# EAGLE schematic CC-Multi-Pak (EAGLE 5.10)

## Sheet 1 of 8
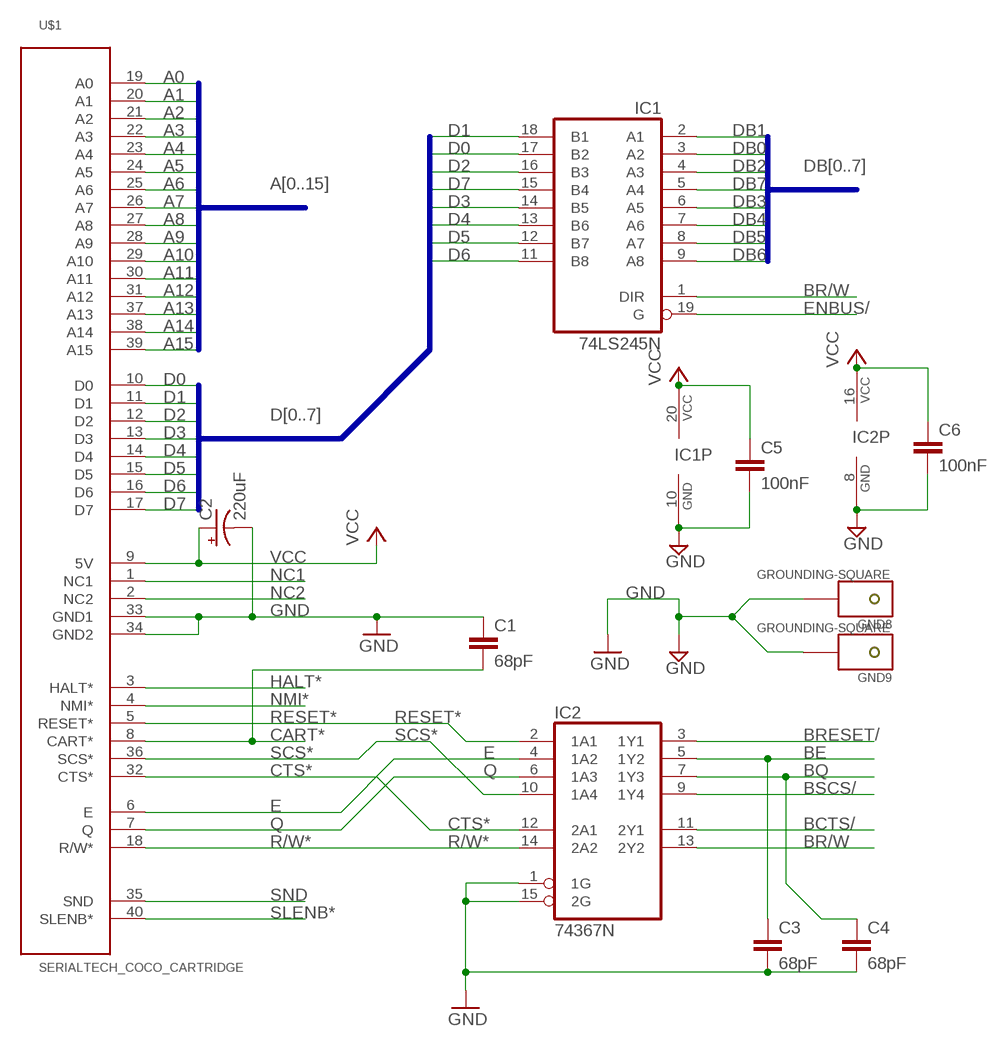
[diagram p0: schematic, sheet 1]

### Parts
C1  68pF  C2.5/6  [C2.5-6]
C2  220uF  SPARKFUN_CAP_POLPTH1  [SPARKFUN_CPOL-RADIAL-100UF-25V]
C3  68pF  C2.5/6  [C2.5-6]
C4  68pF  C2.5/6  [C2.5-6]
C5  100nF  C2.5/4  [C2.5-4]
C6  100nF  C2.5/4  [C2.5-4]
GND8  GROUNDING-SQUARE  [SQUARE]
GND9  GROUNDING-SQUARE  [SQUARE]
IC1  74LS245N  [DIL20]
IC2  74367N  [DIL16]
U$1  SERIALTECH_COCO_CARTRIDGE  [SERIALTECH_EDGE40]

### Nets
A0: U$1.19(A0) ; also sheet 2
A1: U$1.20(A1) ; also sheet 2
A2: U$1.21(A2) ; also sheet 2
A3: U$1.22(A3) ; also sheet 2
A4: U$1.23(A4) ; also sheet 2
A5: U$1.24(A5) ; also sheet 2
A6: U$1.25(A6) ; also sheet 2
A7: U$1.26(A7) ; also sheet 2
A8: U$1.27(A8) ; also sheet 2
A9: U$1.28(A9) ; also sheet 2
A10: U$1.29(A10) ; also sheet 2
A11: U$1.30(A11) ; also sheet 2
A12: U$1.31(A12) ; also sheet 2
A13: U$1.37(A13) ; also sheet 2
A14: U$1.38(A14) ; also sheet 2
A15: U$1.39(A15) ; also sheet 2
BCTS/: IC2.11(2Y1) ; also sheet 3,4
BE: C3.1 IC2.5(1Y2) ; also sheet 4,5
BQ: C4.1 IC2.7(1Y3) ; also sheet 4,5
BR/W: IC1.1(DIR) IC2.13(2Y2) ; also sheet 4,5
BRESET/: IC2.3(1Y1) ; also sheet 3,5
BSCS/: IC2.9(1Y4) ; also sheet 3
CART*: C1.2 U$1.8(CART*) ; also sheet 3
CTS*: IC2.12(2A1) U$1.32(CTS*)
D0: IC1.17(B2) U$1.10(D0)
D1: IC1.18(B1) U$1.11(D1)
D2: IC1.16(B3) U$1.12(D2)
D3: IC1.14(B5) U$1.13(D3)
D4: IC1.13(B6) U$1.14(D4)
D5: IC1.12(B7) U$1.15(D5)
D6: IC1.11(B8) U$1.16(D6)
D7: IC1.15(B4) U$1.17(D7)
DB0: IC1.3(A2) ; also sheet 3,5
DB1: IC1.2(A1) ; also sheet 3,5
DB2: IC1.4(A3) ; also sheet 3,5
DB3: IC1.6(A5) ; also sheet 3,5
DB4: IC1.7(A6) ; also sheet 3,5
DB5: IC1.8(A7) ; also sheet 3,5
DB6: IC1.9(A8) ; also sheet 2,3,5
DB7: IC1.5(A4) ; also sheet 2,3,5
E: IC2.4(1A2) U$1.6(E)
ENBUS/: IC1.19(G) ; also sheet 4
GND [gnd]: C1.1 C2.2(-) C3.2 C4.2 C5.2 C6.2 GND8.GND GND9.GND IC1.10(GND) IC2.1(1G) IC2.8(GND) IC2.15(2G) U$1.33(GND1) U$1.34(GND2) ; also sheet 2,3,4,5,6,7,8
HALT*: U$1.3(HALT*) ; also sheet 5
NC1: U$1.1(NC1)
NC2: U$1.2(NC2)
NMI*: U$1.4(NMI*) ; also sheet 5
Q: IC2.6(1A3) U$1.7(Q)
R/W*: IC2.14(2A2) U$1.18(R/W*)
RESET*: IC2.2(1A1) U$1.5(RESET*) ; also sheet 8
SCS*: IC2.10(1A4) U$1.36(SCS*)
SLENB*: U$1.40(SLENB*) ; also sheet 4,5
SND: U$1.35(SND) ; also sheet 5
VCC [vcc]: C2.1(+) C5.1 C6.1 IC1.20(VCC) IC2.16(VCC) U$1.9(5V) ; also sheet 2,3,4,6,8

### Buses
A[0..15]
D[0..7]
DB[0..7]

## Sheet 2 of 8
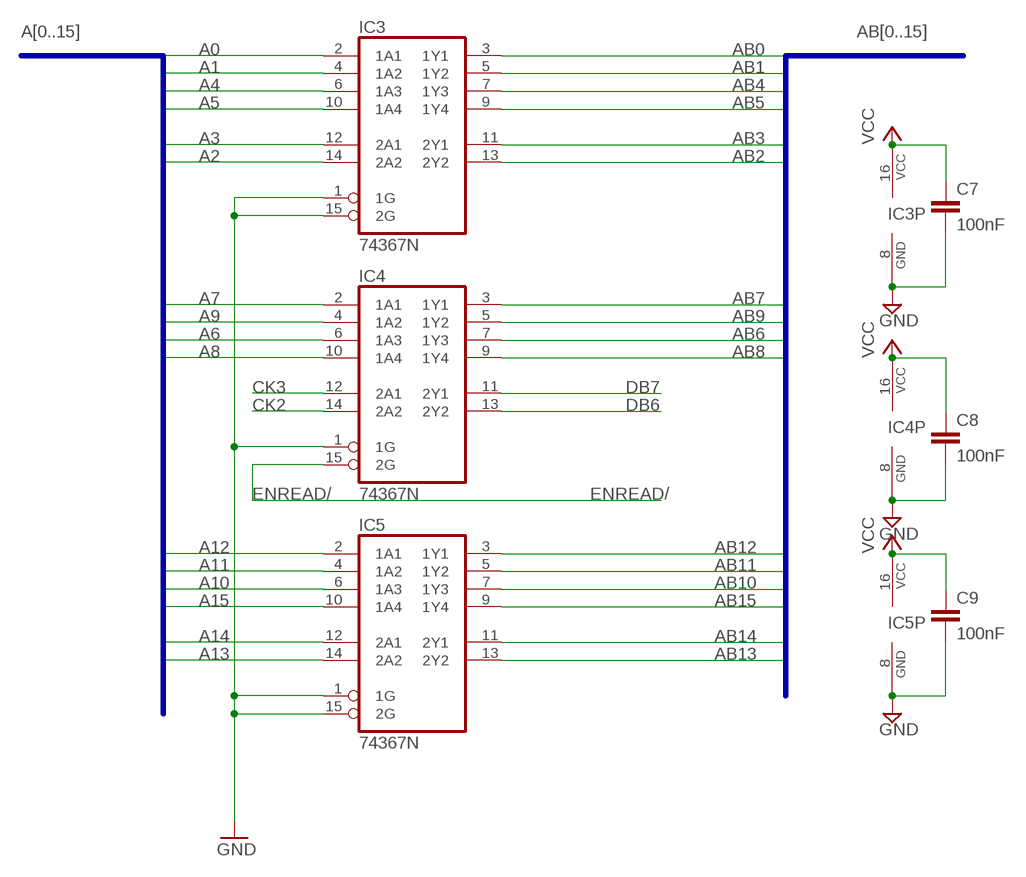
[diagram p1: schematic, sheet 2]

### Parts
C7  100nF  C2.5/4  [C2.5-4]
C8  100nF  C2.5/4  [C2.5-4]
C9  100nF  C2.5/4  [C2.5-4]
IC3  74367N  [DIL16]
IC4  74367N  [DIL16]
IC5  74367N  [DIL16]

### Nets
A0: IC3.2(1A1) ; also sheet 1
A1: IC3.4(1A2) ; also sheet 1
A2: IC3.14(2A2) ; also sheet 1
A3: IC3.12(2A1) ; also sheet 1
A4: IC3.6(1A3) ; also sheet 1
A5: IC3.10(1A4) ; also sheet 1
A6: IC4.6(1A3) ; also sheet 1
A7: IC4.2(1A1) ; also sheet 1
A8: IC4.10(1A4) ; also sheet 1
A9: IC4.4(1A2) ; also sheet 1
A10: IC5.6(1A3) ; also sheet 1
A11: IC5.4(1A2) ; also sheet 1
A12: IC5.2(1A1) ; also sheet 1
A13: IC5.14(2A2) ; also sheet 1
A14: IC5.12(2A1) ; also sheet 1
A15: IC5.10(1A4) ; also sheet 1
AB0: IC3.3(1Y1) ; also sheet 4,5
AB1: IC3.5(1Y2) ; also sheet 4,5
AB2: IC3.13(2Y2) ; also sheet 4,5
AB3: IC3.11(2Y1) ; also sheet 4,5
AB4: IC3.7(1Y3) ; also sheet 4,5
AB5: IC3.9(1Y4) ; also sheet 4,5
AB6: IC4.7(1Y3) ; also sheet 4,5
AB7: IC4.3(1Y1) ; also sheet 4,5
AB8: IC4.9(1Y4) ; also sheet 4,5
AB9: IC4.5(1Y2) ; also sheet 4,5
AB10: IC5.7(1Y3) ; also sheet 4,5
AB11: IC5.5(1Y2) ; also sheet 4,5
AB12: IC5.3(1Y1) ; also sheet 4,5
AB13: IC5.13(2Y2) ; also sheet 4,5
AB14: IC5.11(2Y1) ; also sheet 4,5
AB15: IC5.9(1Y4) ; also sheet 4,5
CK2: IC4.14(2A2) ; also sheet 3
CK3: IC4.12(2A1) ; also sheet 3
DB6: IC4.13(2Y2) ; also sheet 1,3,5
DB7: IC4.11(2Y1) ; also sheet 1,3,5
ENREAD/: IC4.15(2G) ; also sheet 3,4
GND [gnd]: C7.2 C8.2 C9.2 IC3.1(1G) IC3.8(GND) IC3.15(2G) IC4.1(1G) IC4.8(GND) IC5.1(1G) IC5.8(GND) IC5.15(2G) ; also sheet 1,3,4,5,6,7,8
VCC [vcc]: C7.1 C8.1 C9.1 IC3.16(VCC) IC4.16(VCC) IC5.16(VCC) ; also sheet 1,3,4,6,8

### Buses
A[0..15]
AB[0..15]

## Sheet 3 of 8
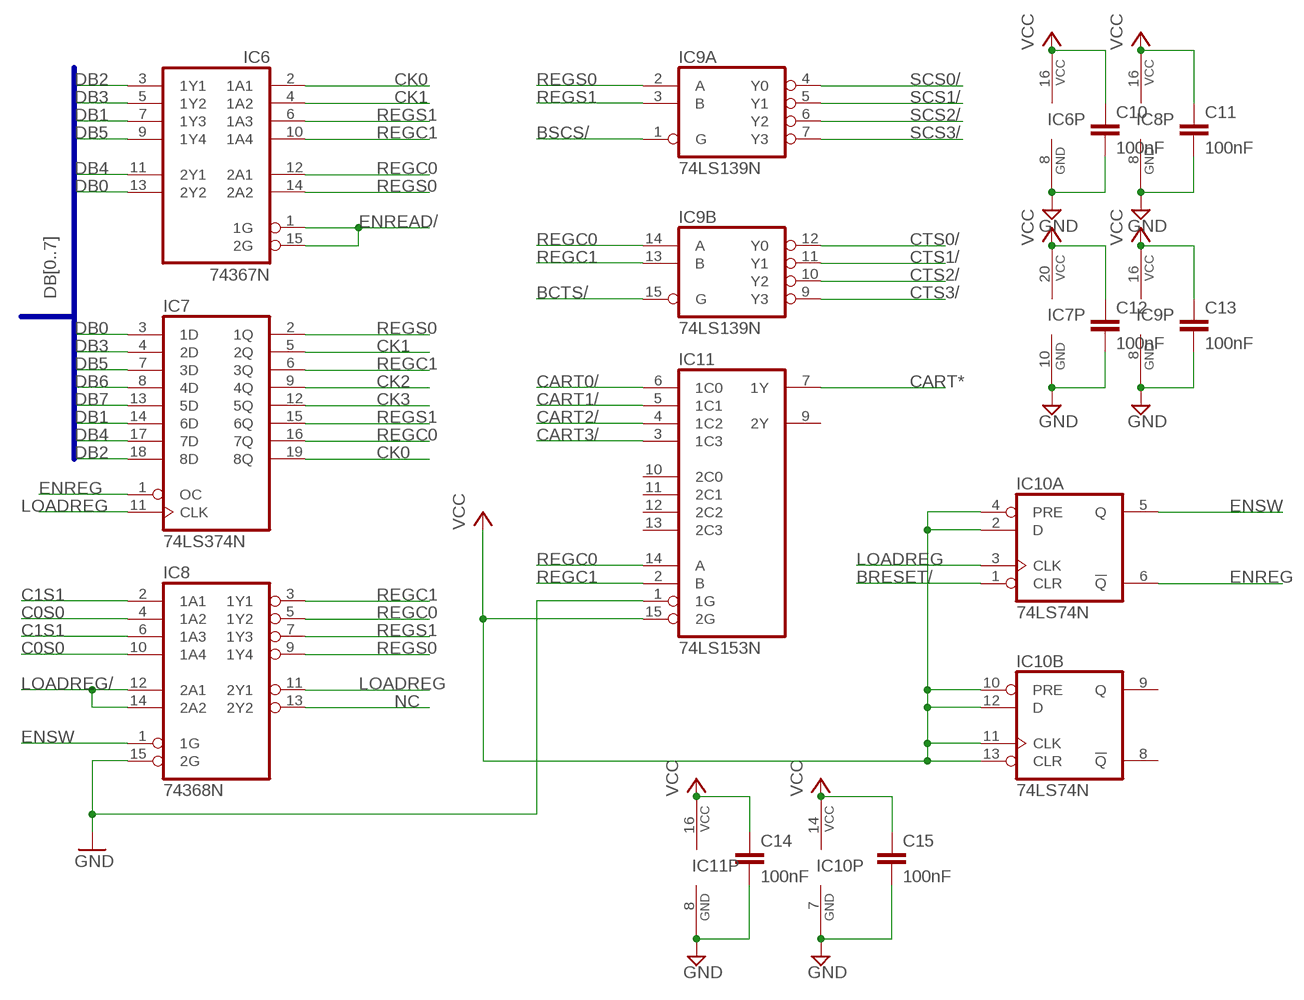
[diagram p2: schematic, sheet 3]

### Parts
C10  100nF  C2.5/4  [C2.5-4]
C11  100nF  C2.5/4  [C2.5-4]
C12  100nF  C2.5/4  [C2.5-4]
C13  100nF  C2.5/4  [C2.5-4]
C14  100nF  C2.5/4  [C2.5-4]
C15  100nF  C2.5/4  [C2.5-4]
IC6  74367N  [DIL16]
IC7  74LS374N  [DIL20]
IC8  74368N  [DIL16]
IC9  74LS139N  [DIL16]
IC10  74LS74N  [DIL14]
IC11  74LS153N  [DIL16]

### Nets
BCTS/: IC9.15(B:G) ; also sheet 1,4
BRESET/: IC10.1(A:CLR) ; also sheet 1,5
BSCS/: IC9.1(A:G) ; also sheet 1
C0S0: IC8.4(1A2) IC8.10(1A4) ; also sheet 6
C1S1: IC8.2(1A1) IC8.6(1A3) ; also sheet 6
CART0/: IC11.6(1C0) ; also sheet 5
CART1/: IC11.5(1C1) ; also sheet 5
CART2/: IC11.4(1C2) ; also sheet 5
CART3/: IC11.3(1C3) ; also sheet 5
CART*: IC11.7(1Y) ; also sheet 1
CK0: IC6.2(1A1) IC7.19(8Q)
CK1: IC6.4(1A2) IC7.5(2Q)
CK2: IC7.9(4Q) ; also sheet 2
CK3: IC7.12(5Q) ; also sheet 2
CTS0/: IC9.12(B:Y0) ; also sheet 5
CTS1/: IC9.11(B:Y1) ; also sheet 5
CTS2/: IC9.10(B:Y2) ; also sheet 5
CTS3/: IC9.9(B:Y3) ; also sheet 5
DB0: IC6.13(2Y2) IC7.3(1D) ; also sheet 1,5
DB1: IC6.7(1Y3) IC7.14(6D) ; also sheet 1,5
DB2: IC6.3(1Y1) IC7.18(8D) ; also sheet 1,5
DB3: IC6.5(1Y2) IC7.4(2D) ; also sheet 1,5
DB4: IC6.11(2Y1) IC7.17(7D) ; also sheet 1,5
DB5: IC6.9(1Y4) IC7.7(3D) ; also sheet 1,5
DB6: IC7.8(4D) ; also sheet 1,2,5
DB7: IC7.13(5D) ; also sheet 1,2,5
ENREAD/: IC6.1(1G) IC6.15(2G) ; also sheet 2,4
ENREG: IC7.1(OC) IC10.6(A:!Q)
ENSW: IC8.1(1G) IC10.5(A:Q)
GND [gnd]: C10.2 C11.2 C12.2 C13.2 C14.2 C15.2 IC6.8(GND) IC7.10(GND) IC8.8(GND) IC8.15(2G) IC9.8(P:GND) IC10.7(P:GND) IC11.1(1G) IC11.8(GND) ; also sheet 1,2,4,5,6,7,8
LOADREG: IC7.11(CLK) IC8.11(2Y1) IC10.3(A:CLK)
LOADREG/: IC8.12(2A1) IC8.14(2A2) ; also sheet 4
NC: IC8.13(2Y2)
REGC0: IC6.12(2A1) IC7.16(7Q) IC8.5(1Y2) IC9.14(B:A) IC11.14(A)
REGC1: IC6.10(1A4) IC7.6(3Q) IC8.3(1Y1) IC9.13(B:B) IC11.2(B)
REGS0: IC6.14(2A2) IC7.2(1Q) IC8.9(1Y4) IC9.2(A:A)
REGS1: IC6.6(1A3) IC7.15(6Q) IC8.7(1Y3) IC9.3(A:B)
SCS0/: IC9.4(A:Y0) ; also sheet 5
SCS1/: IC9.5(A:Y1) ; also sheet 5
SCS2/: IC9.6(A:Y2) ; also sheet 5
SCS3/: IC9.7(A:Y3) ; also sheet 5
VCC [vcc]: C10.1 C11.1 C12.1 C13.1 C14.1 C15.1 IC6.16(VCC) IC7.20(VCC) IC8.16(VCC) IC9.16(P:VCC) IC10.2(A:D) IC10.4(A:PRE) IC10.10(B:PRE) IC10.11(B:CLK) IC10.12(B:D) IC10.13(B:CLR) IC10.14(P:VCC) IC11.15(2G) IC11.16(VCC) ; also sheet 1,2,4,6,8
Unconnected: IC10.8(B:!Q) IC10.9(B:Q) IC11.9(2Y) IC11.10(2C0) IC11.11(2C1) IC11.12(2C2) IC11.13(2C3)

### Buses
DB[0..7]

## Sheet 4 of 8
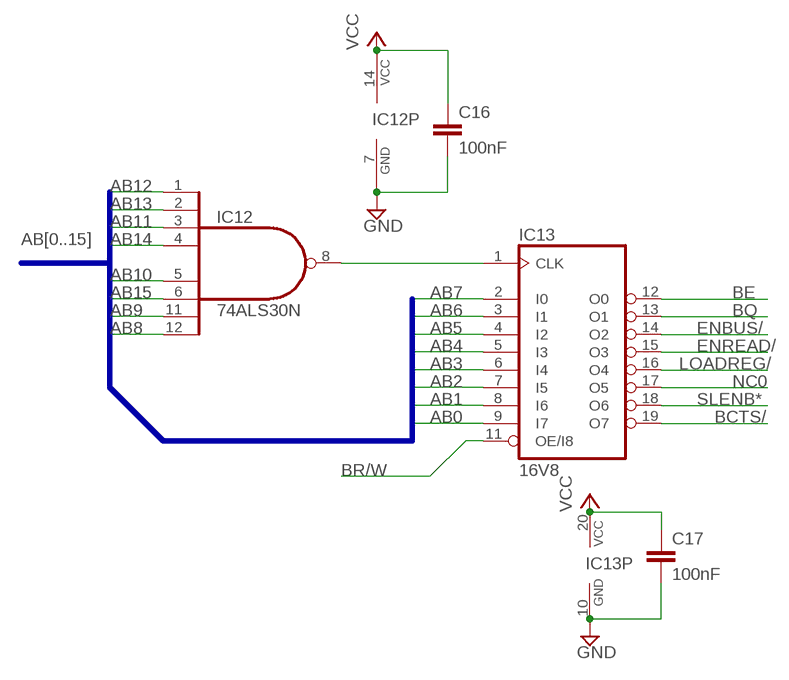
[diagram p3: schematic, sheet 4]

### Parts
C16  100nF  C2.5/4  [C2.5-4]
C17  100nF  C2.5/4  [C2.5-4]
IC12  74ALS30N  [DIL14]
IC13  16V8  [DIL20]

### Nets
AB0: IC13.9(I7) ; also sheet 2,5
AB1: IC13.8(I6) ; also sheet 2,5
AB2: IC13.7(I5) ; also sheet 2,5
AB3: IC13.6(I4) ; also sheet 2,5
AB4: IC13.5(I3) ; also sheet 2,5
AB5: IC13.4(I2) ; also sheet 2,5
AB6: IC13.3(I1) ; also sheet 2,5
AB7: IC13.2(I0) ; also sheet 2,5
AB8: IC12.12(I7) ; also sheet 2,5
AB9: IC12.11(I6) ; also sheet 2,5
AB10: IC12.5(I4) ; also sheet 2,5
AB11: IC12.3(I2) ; also sheet 2,5
AB12: IC12.1(I0) ; also sheet 2,5
AB13: IC12.2(I1) ; also sheet 2,5
AB14: IC12.4(I3) ; also sheet 2,5
AB15: IC12.6(I5) ; also sheet 2,5
BCTS/: IC13.19(O7) ; also sheet 1,3
BE: IC13.12(O0) ; also sheet 1,5
BQ: IC13.13(O1) ; also sheet 1,5
BR/W: IC13.11(OE/I8) ; also sheet 1,5
ENBUS/: IC13.14(O2) ; also sheet 1
ENREAD/: IC13.15(O3) ; also sheet 2,3
GND [gnd]: C16.2 C17.2 IC12.7(GND) IC13.10(GND) ; also sheet 1,2,3,5,6,7,8
LOADREG/: IC13.16(O4) ; also sheet 3
N$1: IC12.8(O) IC13.1(CLK)
NC0: IC13.17(O5)
SLENB*: IC13.18(O6) ; also sheet 1,5
VCC [vcc]: C16.1 C17.1 IC12.14(VCC) IC13.20(VCC) ; also sheet 1,2,3,6,8

### Buses
AB[0..15]

## Sheet 5 of 8
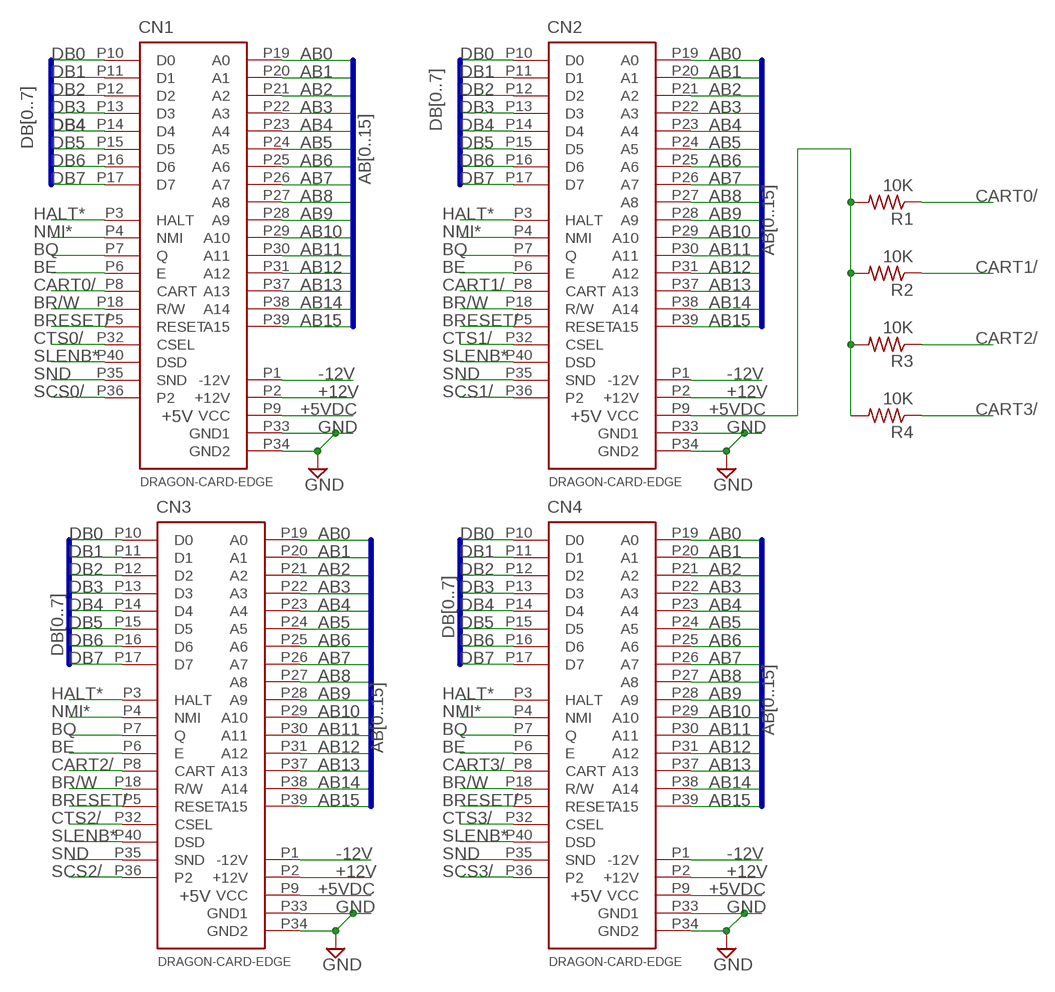
[diagram p4: schematic, sheet 5]

### Parts
CN1  DRAGON-CARD-EDGE  [EDGE-CON-40]
CN2  DRAGON-CARD-EDGE  [EDGE-CON-40]
CN3  DRAGON-CARD-EDGE  [EDGE-CON-40]
CN4  DRAGON-CARD-EDGE  [EDGE-CON-40]
R1  10K  R-US_0207/7  [0207/7]
R2  10K  R-US_0207/7  [0207/7]
R3  10K  R-US_0207/7  [0207/7]
R4  10K  R-US_0207/7  [0207/7]

### Nets
+5VDC [5v]: CN1.P9(VCC) CN2.P9(VCC) CN3.P9(VCC) CN4.P9(VCC) R1.2 R2.2 R3.2 R4.2 ; also sheet 7,8
+12V [12v]: CN1.P2(+12V) CN2.P2(+12V) CN3.P2(+12V) CN4.P2(+12V) ; also sheet 7
-12V: CN1.P1(-12V) CN2.P1(-12V) CN3.P1(-12V) CN4.P1(-12V) ; also sheet 7
AB0: CN1.P19(A0) CN2.P19(A0) CN3.P19(A0) CN4.P19(A0) ; also sheet 2,4
AB1: CN1.P20(A1) CN2.P20(A1) CN3.P20(A1) CN4.P20(A1) ; also sheet 2,4
AB2: CN1.P21(A2) CN2.P21(A2) CN3.P21(A2) CN4.P21(A2) ; also sheet 2,4
AB3: CN1.P22(A3) CN2.P22(A3) CN3.P22(A3) CN4.P22(A3) ; also sheet 2,4
AB4: CN1.P23(A4) CN2.P23(A4) CN3.P23(A4) CN4.P23(A4) ; also sheet 2,4
AB5: CN1.P24(A5) CN2.P24(A5) CN3.P24(A5) CN4.P24(A5) ; also sheet 2,4
AB6: CN1.P25(A6) CN2.P25(A6) CN3.P25(A6) CN4.P25(A6) ; also sheet 2,4
AB7: CN1.P26(A7) CN2.P26(A7) CN3.P26(A7) CN4.P26(A7) ; also sheet 2,4
AB8: CN1.P27(A8) CN2.P27(A8) CN3.P27(A8) CN4.P27(A8) ; also sheet 2,4
AB9: CN1.P28(A9) CN2.P28(A9) CN3.P28(A9) CN4.P28(A9) ; also sheet 2,4
AB10: CN1.P29(A10) CN2.P29(A10) CN3.P29(A10) CN4.P29(A10) ; also sheet 2,4
AB11: CN1.P30(A11) CN2.P30(A11) CN3.P30(A11) CN4.P30(A11) ; also sheet 2,4
AB12: CN1.P31(A12) CN2.P31(A12) CN3.P31(A12) CN4.P31(A12) ; also sheet 2,4
AB13: CN1.P37(A13) CN2.P37(A13) CN3.P37(A13) CN4.P37(A13) ; also sheet 2,4
AB14: CN1.P38(A14) CN2.P38(A14) CN3.P38(A14) CN4.P38(A14) ; also sheet 2,4
AB15: CN1.P39(A15) CN2.P39(A15) CN3.P39(A15) CN4.P39(A15) ; also sheet 2,4
BE: CN1.P6(E) CN2.P6(E) CN3.P6(E) CN4.P6(E) ; also sheet 1,4
BQ: CN1.P7(Q) CN2.P7(Q) CN3.P7(Q) CN4.P7(Q) ; also sheet 1,4
BR/W: CN1.P18(R/W) CN2.P18(R/W) CN3.P18(R/W) CN4.P18(R/W) ; also sheet 1,4
BRESET/: CN1.P5(RESET) CN2.P5(RESET) CN3.P5(RESET) CN4.P5(RESET) ; also sheet 1,3
CART0/: CN1.P8(CART) R1.1 ; also sheet 3
CART1/: CN2.P8(CART) R2.1 ; also sheet 3
CART2/: CN3.P8(CART) R3.1 ; also sheet 3
CART3/: CN4.P8(CART) R4.1 ; also sheet 3
CTS0/: CN1.P32(CSEL) ; also sheet 3
CTS1/: CN2.P32(CSEL) ; also sheet 3
CTS2/: CN3.P32(CSEL) ; also sheet 3
CTS3/: CN4.P32(CSEL) ; also sheet 3
DB0: CN1.P10(D0) CN2.P10(D0) CN3.P10(D0) CN4.P10(D0) ; also sheet 1,3
DB1: CN1.P11(D1) CN2.P11(D1) CN3.P11(D1) CN4.P11(D1) ; also sheet 1,3
DB2: CN1.P12(D2) CN2.P12(D2) CN3.P12(D2) CN4.P12(D2) ; also sheet 1,3
DB3: CN1.P13(D3) CN2.P13(D3) CN3.P13(D3) CN4.P13(D3) ; also sheet 1,3
DB4: CN1.P14(D4) CN2.P14(D4) CN3.P14(D4) CN4.P14(D4) ; also sheet 1,3
DB5: CN1.P15(D5) CN2.P15(D5) CN3.P15(D5) CN4.P15(D5) ; also sheet 1,3
DB6: CN1.P16(D6) CN2.P16(D6) CN3.P16(D6) CN4.P16(D6) ; also sheet 1,2,3
DB7: CN1.P17(D7) CN2.P17(D7) CN3.P17(D7) CN4.P17(D7) ; also sheet 1,2,3
GND [gnd]: CN1.P33(GND1) CN1.P34(GND2) CN2.P33(GND1) CN2.P34(GND2) CN3.P33(GND1) CN3.P34(GND2) CN4.P33(GND1) CN4.P34(GND2) ; also sheet 1,2,3,4,6,7,8
HALT*: CN1.P3(HALT) CN2.P3(HALT) CN3.P3(HALT) CN4.P3(HALT) ; also sheet 1
NMI*: CN1.P4(NMI) CN2.P4(NMI) CN3.P4(NMI) CN4.P4(NMI) ; also sheet 1
SCS0/: CN1.P36(P2) ; also sheet 3
SCS1/: CN2.P36(P2) ; also sheet 3
SCS2/: CN3.P36(P2) ; also sheet 3
SCS3/: CN4.P36(P2) ; also sheet 3
SLENB*: CN1.P40(DSD) CN2.P40(DSD) CN3.P40(DSD) CN4.P40(DSD) ; also sheet 1,4
SND: CN1.P35(SND) CN2.P35(SND) CN3.P35(SND) CN4.P35(SND) ; also sheet 1

### Buses
DB[0..7]
AB[0..15]

## Sheet 6 of 8
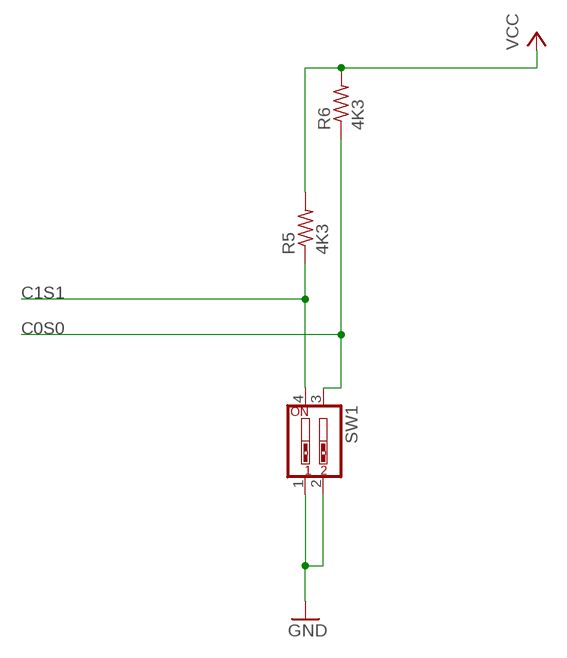
[diagram p5: schematic, sheet 6]

### Parts
R5  4K3  R-US_0207/7  [0207/7]
R6  4K3  R-US_0207/7  [0207/7]
SW1  SW_DIP-2  [DIPSWITCH-02]

### Nets
C0S0: R6.1 SW1.3 ; also sheet 3
C1S1: R5.1 SW1.4 ; also sheet 3
GND [gnd]: SW1.1 SW1.2 ; also sheet 1,2,3,4,5,7,8
VCC [vcc]: R5.2 R6.2 ; also sheet 1,2,3,4,8

## Sheet 7 of 8
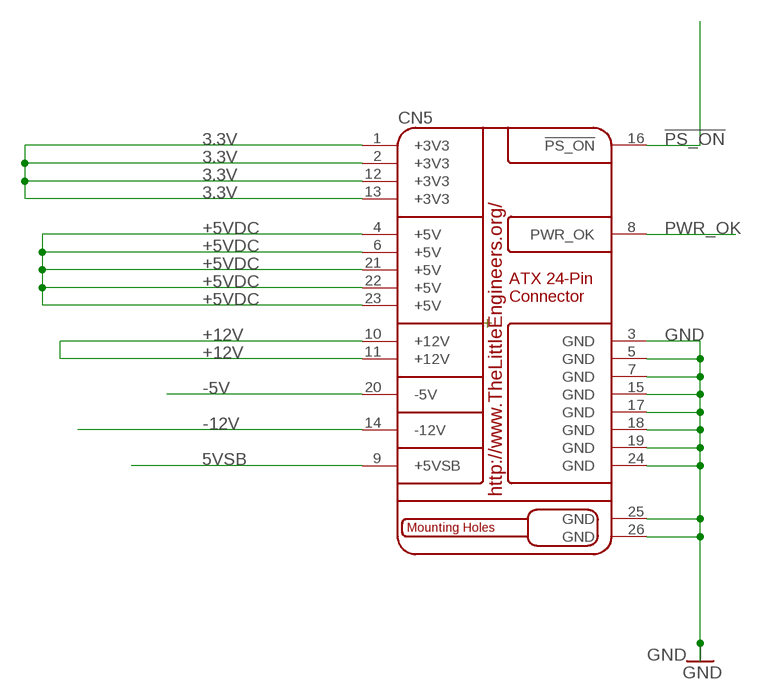
[diagram p6: schematic, sheet 7]

### Parts
CN5  ATX-2.X-UNIVERSAL  [ATX-UNIVERSAL]

### Nets
3.3V [3.3v]: CN5.1(+3V3) CN5.2(+3V3) CN5.12(+3V3) CN5.13(+3V3)
5VSB: CN5.9(+5VSB)
!PS_ON: CN5.16(!PS_ON) ; also sheet 8
+5VDC [5v]: CN5.4(+5V) CN5.6(+5V) CN5.21(+5V) CN5.22(+5V) CN5.23(+5V) ; also sheet 5,8
+12V [12v]: CN5.10(+12V) CN5.11(+12V) ; also sheet 5
-5V [-5v]: CN5.20(-5V)
-12V: CN5.14(-12V) ; also sheet 5
GND [gnd]: CN5.3(GND) CN5.5(GND) CN5.7(GND) CN5.15(GND) CN5.17(GND) CN5.18(GND) CN5.19(GND) CN5.24(GND) CN5.25(GND) CN5.26(GND) ; also sheet 1,2,3,4,5,6,8
PWR_OK: CN5.8(PWR_OK) ; also sheet 8

## Sheet 8 of 8
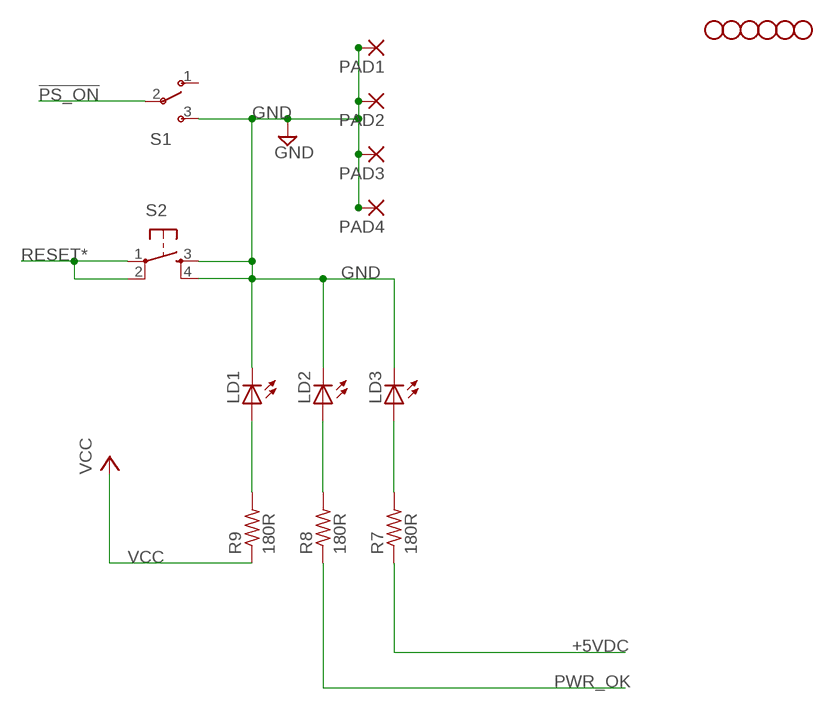
[diagram p7: schematic, sheet 8]

### Parts
LD1  LED5MM  [LED5MM]
LD2  LED5MM  [LED5MM]
LD3  LED5MM  [LED5MM]
PAD1  3,81/1,4  [3,81/1,4]
PAD2  3,81/1,4  [3,81/1,4]
PAD3  3,81/1,4  [3,81/1,4]
PAD4  3,81/1,4  [3,81/1,4]
R7  180R  R-US_0207/7  [0207/7]
R8  180R  R-US_0207/7  [0207/7]
R9  180R  R-US_0207/7  [0207/7]
S1  SWITCH-SPST  [SWITCH-SPST]
S2  TAC_SWITCHPTH  [TACTILE-PTH]
U$2  SPARKFUN_STAND-OFF  [SPARKFUN_STAND-OFF]
U$3  SPARKFUN_STAND-OFF  [SPARKFUN_STAND-OFF]
U$4  SPARKFUN_STAND-OFF  [SPARKFUN_STAND-OFF]
U$5  SPARKFUN_STAND-OFF  [SPARKFUN_STAND-OFF]
U$6  SPARKFUN_STAND-OFF  [SPARKFUN_STAND-OFF]
U$7  SPARKFUN_STAND-OFF  [SPARKFUN_STAND-OFF]

### Nets
!PS_ON: S1.2(P) ; also sheet 7
+5VDC [5v]: R7.1 ; also sheet 5,7
GND [gnd]: LD1.K(C) LD2.K(C) LD3.K(C) PAD1.1(P) PAD2.1(P) PAD3.1(P) PAD4.1(P) S1.3(S) S2.3 S2.4 ; also sheet 1,2,3,4,5,6,7
N$2: LD1.A R9.2
N$3: LD2.A R8.2
N$4: LD3.A R7.2
PWR_OK: R8.1 ; also sheet 7
RESET*: S2.1 S2.2 ; also sheet 1
VCC [vcc]: R9.1 ; also sheet 1,2,3,4,6
Unconnected: S1.1(O)

## Library data of the parts
C1 C3-C17 = capacitor-wima:C: CAPACITOR naming: grid - package width
C2 = FDC:SPARKFUN_CAP_POL: Capacitor Polarized These are standard SMD and PTH capacitors. Normally 10uF, 47uF, and 100uF in electrolytic and tantalum varieties. Always verify the external diameter of the through hole cap, it varies with capacity, voltage, and manufacturer. The EIA devices should be standard.
CN1-CN4 = Conn-CoCo:DRAGON-CARD-EDGE: Dragon and CoCo cartridge port, as seen by computer, or Multipak
CN5 = ATX_Power_Supply:ATX-2.X: 24-pin ATX PC-Motherboard 2.x Power Supply Connector. 24-pin ATX PC-Motherboard 2.x Power Supply Connector. 24-pin ATX PC-Motherboard 2.x Power Supply Connector. Package: 5566-24 Mini FIT connector 24 pin. Source: http://www.molex.com This is the Molex connector originally developed by Molex Connector Company. In the connector, cylindrical spring-metal pins fit into cylindrical spring-metal sockets. The pins and sockets are held in a rectangular matrix in a nylon shell. The connector typically is polarized or keyed to ensure correct orientation. The connector may also be known as: MOLEX-5566-24, MOLEX-5566-24A, MOLEX-44206-0007, Molex Mini-fit, Molex Mini-fit Jr., and others. The actual component that you intend to use in your design should be checked against a 1:1 printout of this library component/footprint prior to use. Color Signal Pin Pin Signal Color Orange +3.3 V 1 13 +3.3 V Orange +3.3 V sense Brown Orange +3.3 V 2 14 -12 V Blue Black Ground 3 15 Ground Black Red +5 V 4 16 Power on Green Black Ground 5 17 Ground Black Red +5 V 6 18 Ground Black Black Ground 7 19 Ground Black Grey Power good 8 20 -5 V (Optional) White Purple +5 V standby 9 21 +5 V Red Yellow +12 V 10 22 +5 V Red Yellow +12 V 11 23 +5 V Red Orange +3.3 V 12 24 Ground Black Pins 8, and 16 (shaded) are control signals, not power: Power on is pulled up to +5 V by the PSU, and must be driven low to turn on the PSU. Power good is low when other outputs have not yet reached, or are about to leave, correct voltages. Pin 13 supplies +3.3 V power and also has a second thinner wire for remote sensing. Pin 20 (formerly -5 V, white wire) is absent in current power supplies; it was optional in ATX and ATX12V ver. 1.2, and deleted as of ver. 1.3. Copyright ©11 November 2013 (Happy Veteran's Day), by: John Turner Licensed to: RetroZilla, LLC <http://www.RetroZillaLLC.com> sales@RetroZillaLLC.com RetroZilla, LLC <http://www.RetroZillaLLC.com> symbols/components/footprints for EAGLE v5.xx. The symbols/components/footprints contained within this library were created by John Turner and have been licensed to RetroZilla, LLC. <http://www.RetroZillaLLC.com> You may use these symbols/components/footprints in your own projects, for non-commercial purposes only, however, please take note that we CANNOT guarantee the accuracy of these symbols/components/footprints nor any part of this library. We make NO guarantees that the components, footprints or schematic symbols in this library are flawless, and we make no promises of fitness for production, prototyping or any other purpose. These libraries are provided for informational purposes only, and are used at your own discretion. By downloading and/or using these libraries, you agree that we cannot be held responsible for faulty PCBs. You should always check the footprints with a 1:1 printout. Neither John Turner, RetroZillaLLC.com, RetroZilla, LLC <http://www.RetroZillaLLC.com> nor anyone affiliated with same shall be held responsible for any outcome resulting from the usage of these files (library/symbols/components/footprints, etc). Should any errors be found, please contact us at the above email address and we will attempt to repair them.
GND8 GND9 = CC2-BufferPack-V1R0-21-May-2019:GROUNDING
IC1 = 74xx-us:74*245: Octal BUS TRANSCEIVER, 3-state
IC2-IC6 = 74xx-us:74*367: Hex BUS DRIVER, 3-state
IC7 = 74xx-us:74*374: Octal D type transparent LATCH, edge triggered
IC8 = 74xx-us:74*368: Hex BUS DRIVER, 3-state
IC9 = 74xx-us:74*139: Dual 2-line to 4-line DECODER/DEMULTIPLEXER
IC10 = 74xx-us:74*74: Dual D type positive edge triggered FLIP FLOP, preset and clear
IC11 = 74xx-us:74*153: Dual 4-line to 1-line data SELECTOR/MULTIPLEXER
IC12 = 74xx-us:74*30: 8-input NAND gate
IC13 = pal:16V8: PAL
LD1-LD3 = led:LED: LED OSRAM: - CHIPLED LG R971, LG N971, LY N971, LG Q971, LY Q971, LO R971, LY R971 LH N974, LH R974 LS Q976, LO Q976, LY Q976 LO Q996 - Hyper CHIPLED LW Q18S LB Q993, LB Q99A, LB R99A - SideLED LS A670, LO A670, LY A670, LG A670, LP A670 LB A673, LV A673, LT A673, LW A673 LH A674 LY A675 LS A676, LA A676, LO A676, LY A676, LW A676 LS A679, LY A679, LG A679 - Hyper Micro SIDELED® LS Y876, LA Y876, LO Y876, LY Y876 LT Y87S - SmartLED LW L88C, LW L88S LB L89C, LB L89S, LG L890 LS L89K, LO L89K, LY L89K LS L896, LA L896, LO L896, LY L896 - TOPLED LS T670, LO T670, LY T670, LG T670, LP T670 LSG T670, LSP T670, LSY T670, LOP T670, LYG T670 LG T671, LOG T671, LSG T671 LB T673, LV T673, LT T673, LW T673 LH T674 LS T676, LA T676, LO T676, LY T676, LB T676, LH T676, LSB T676, LW T676 LB T67C, LV T67C, LT T67C, LS T67K, LO T67K, LY T67K, LW E67C LS E67B, LA E67B, LO E67B, LY E67B, LB E67C, LV E67C, LT E67C LW T67C LS T679, LY T679, LG T679 LS T770, LO T770, LY T770, LG T770, LP T770 LB T773, LV T773, LT T773, LW T773 LH T774 LS E675, LA E675, LY E675, LS T675 LS T776, LA T776, LO T776, LY T776, LB T776 LHGB T686 LT T68C, LB T68C - Hyper Mini TOPLED® LB M676 - Mini TOPLED Santana® LG M470 LS M47K, LO M47K, LY M47K Source: http://www.osram.convergy.de/
PAD1-PAD4 = wirepad:3,81/1,4: THROUGH-HOLE PAD
R1-R9 = rcl-2:R-US_: RESISTOR, American symbol
S1 = SparkFun-3-2-07:SWITCH-SPST: SPST Switch Simple slide switch. Spark Fun Electronics SKU : Comp-SW1
S2 = SparkFunEagle-6-6-07:TAC_SWITCH: Momentary Switch Button commonly used for reset or general input. Spark Fun Electronics SKU : COM-00097
SW1 = SparkFun:SW_DIP-2: DIP SWITCH
U$1 = FDC:SERIALTECH_COCO_CARTRIDGE
U$2-U$7 = FDC:SPARKFUN_STAND-OFF: Stand Off This is the mechanical footprint for a #4 phillips button head screw. Use the keepout ring to avoid running the screw head into surrounding components. SKU : PRT-00447

## Net classes
0 default: width 0.254 mm, drill 0.508 mm, clearance 0.254 mm
1 vcc: width 0.762 mm, drill 0.508 mm, clearance 0.381 mm
2 gnd: width 0.762 mm, drill 0.508 mm, clearance 0.381 mm
3 12v: width 0.762 mm, drill 0.508 mm, clearance 0.381 mm
4 -12v: width 0.762 mm, drill 0.508 mm, clearance 0.381 mm
5 3.3v: width 0.762 mm, drill 0.508 mm, clearance 0.381 mm
6 5v: width 0.762 mm, drill 0.381 mm, clearance 0.381 mm
7 -5v: width 0.762 mm, drill 0.381 mm, clearance 0.381 mm